# Altium schematic sheet DCDCreg.SchDoc: Regulated Buck-Boost I2C
size 292 x 193 mm; CheckedBy: Jakub Howors; Author: Łukasz Gójski; CompanyName: Politechnika Warszawska; Organization: EITI; Address1: Nowowiejska 15/19; Address2: 00-665 Warszawa; SheetNumber: 4; SheetTotal: 13; HTTPLink: www.pw.edu.pl
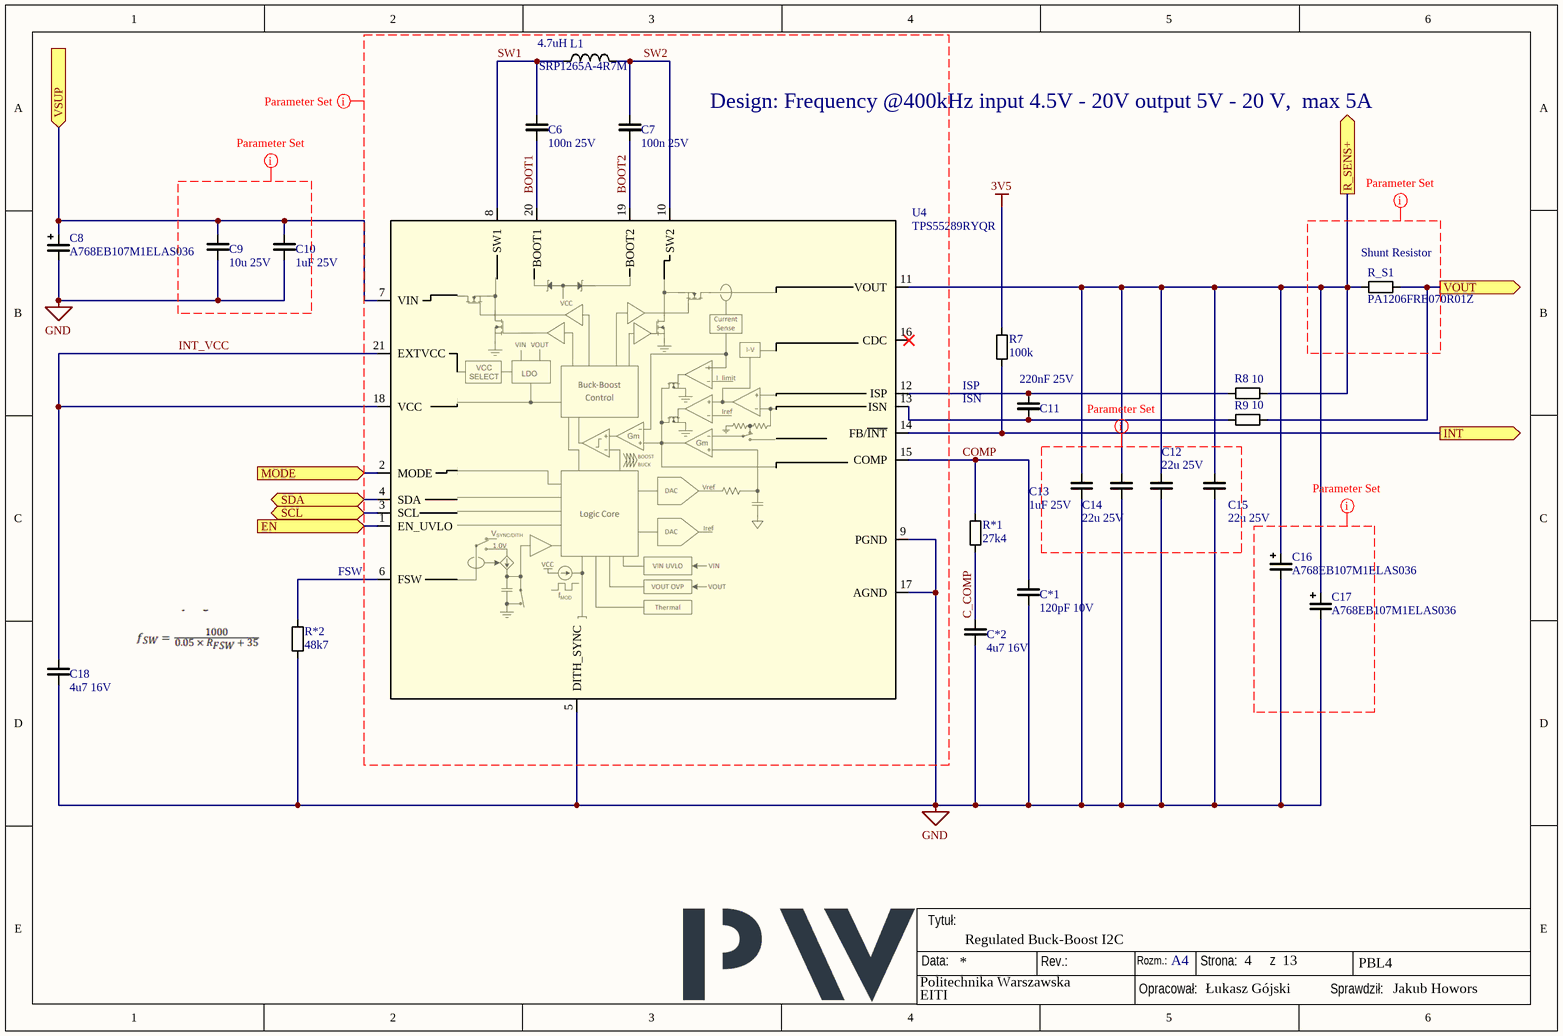
[diagram p0: DCDCreg.SchDoc]

## Parts
C6  100n 25V  [C_0603]
C7  100n 25V  [C_0603]
C8  A768EB107M1ELAS036  [CAP_A768EB_6.8x6.8_KEM]
C9  10u 25V  [C_0805]
C10  1uF 25V  [C_0603]
C11  220nF 25V  [C_0603]
C12  22u 25V  [C_1206]
C13  1uF 25V  [C_0603]
C14  22u 25V  [C_1206]
C15  22u 25V  [C_1206]
C16  A768EB107M1ELAS036  [CAP_A768EB_6.8x6.8_KEM]
C17  A768EB107M1ELAS036  [CAP_A768EB_6.8x6.8_KEM]
C18  4u7 16V  [C_0603]
C*1  120pF 10V  [C_0603]
C*2  4u7 16V  [C_0603]
L1  SRP1265A-4R7M  [SRP1265A-4R7M]
R7  100k  [R_0603]
R8  10  [R_0603]
R9  10  [R_0603]
R*1  27k4  [R_0603]
R*2  48k7  [R_0603]
R_S1  PA1206FRE070R01Z  [R_1206]
U4  TPS55289RYQR  [RYQ0021A-MFG]

## Ports
EN (in, see PowerAssembly[5B]), INT (out, see PowerAssembly[6B]), MODE (in, see PowerAssembly[5C]), R_SENS+ (out, see PowerAssembly[6B]), SCL (bidir, see PowerAssembly[5B], ADCHighVoltageInputsSchDoc[2A], DAC[3C], GPIOExpander[2B], PWMExpander[2B], USBPD[4C]), SDA (bidir, see PowerAssembly[5B], ADCHighVoltageInputsSchDoc[2A], DAC[3C], GPIOExpander[2B], PWMExpander[2A], USBPD[4C]), VOUT (out, see PowerAssembly[6B]), VSUP (in, see PowerAssembly[5B])

## Nets
3V5: R7.2
GND: C8.2 C9.1 C10.1 C12.1 C13.1 C14.1 C15.1 C16.2 C17.2 C18.1 C*1.1 C*2.1 R*2.1 U4.5(DITH_SYNC) U4.9(PGND) U4.17(AGND)
BOOT1: C6.1 U4.20(BOOT1)
BOOT2: C7.1 U4.19(BOOT2)
C_COMP: C*2.2 R*1.1
COMP: C*1.2 R*1.2 U4.15(COMP)
EN: U4.1(EN_UVLO) ; port EN
INT: R7.1 U4.14(FB/~{INT}) ; port INT
INT_VCC: C18.2 U4.18(VCC) U4.21(EXTVCC)
MODE: U4.2(MODE) ; port MODE
R_SENS+: C12.2 C13.2 C14.2 C15.2 C16.1 C17.1 R8.1 R_S1.1 U4.11(VOUT) ; port R_SENS+
SCL: U4.3(SCL) ; port SCL
SDA: U4.4(SDA) ; port SDA
SW1: C6.2 L1.1 U4.8(SW1)
SW2: C7.2 L1.2 U4.10(SW2)
VOUT: R9.1 R_S1.2 ; port VOUT
VSUP: C8.1 C9.2 C10.2 U4.7(VIN) ; port VSUP
NetC11_1: C11.1 R9.2 U4.13(ISN)
NetC11_2: C11.2 R8.2 U4.12(ISP)
NetR*2_2: R*2.2 U4.6(FSW)

Not connected (* = marked no-connect by the designer): U4 16(CDC)*

## Layout directives
CompClassName: NoRelief: (no net found under the mark), BOOT1, BOOT2, R_SENS+, SW1, SW2
CompClassName: ThickRelief: (no net found under the mark)

## Notes on the sheet
- (near L1) 4.7uH
- Design: Frequency @400kHz input 4.5V - 20V output 5V - 20 V,  max 5A
- (near R_S1) Shunt Resistor
- (near R7) ISP
- ISN
- (near U4) FSW
- Data:
- Tytuł:
- Rev.:
- Rozm.:
- A4
- Strona:
- z
- PBL4
- Opracował:
- Sprawdził:

## Library data of the parts
C6 C7 = C_100nF_25V: Ceramic capacitor; Casing: 0603; Dielectric: X7R; Tolerance: 10%; Value: 100n; Voltage: 25V; Technology: Ceramic
C8 C16 C17 = C_Pol_100uF_25V: Aluminum Organic Polymer Capacitors 25Vol 100uF SMD 2KHr ESR=36 mOhms AECQ200; Manufacturer: KEMET; Voltage: 25V; Tolerance: 20%; Value: 100uF; ComponentLink1Description: Datasheet; ComponentLink1URL: https://yageogroup.com/content/datasheet/asset/file/KEM_A4088_A768; ComponentLink2Description: Supplier; ComponentLink2URL: https://www.digikey.pl/pl/products/detail/kemet/A768EB107M1ELAS036/13420071
C9 = C_10uF_25V: Ceramic capacitor; Casing: 0805; Dielectric: X5R; Tolerance: 10%; Value: 10u; Voltage: 25V; Technology: Ceramic
C10 C13 = C_1uF_25V: Ceramic capacitor; Value: 1u; Casing: 0603; Dielectric: XR7; Tolerance: 10%; Voltage: 25V; Technology: Ceramic
C11 = C_220nF_25V: Ceramic capacitor; Value: 220n; Casing: 0603; Dielectric: XR7; Tolerance: 10%; Voltage: 25V; Technology: Ceramic
C12 C14 C15 = C_22uF_25V: Ceramic capacitor; Casing: 1206; Dielectric: X7R; Tolerance: 20%; Value: 22u; Voltage: 25V; Technology: Ceramic
C18 C*2 = C_4u7_16V: Ceramic capacitor; Casing: 0603; Dielectric: X5R; Tolerance: 10%; Value: 4u7; Voltage: 16V; Technology: Ceramic
C*1 = C_120pF_10V: Ceramic capacitor; Value: 120p; Casing: 0603; Dielectric: XR7; Tolerance: 10%; Voltage: 10V; Technology: Ceramic
L1 = L_4u7_10.5A: Inductor, 4.7 uF , 10A; Manufacturer: Bourns Inc.; Value: 4u7; Tolerance: 20%; IDC: 10A
R7 = R_100k: Resistor; Tolerance: 1%; Power: 100mW; Casing: 0603; Value: 100k
R8 R9 = R_10R: Tolerance: 1%; Power: 100mW; Casing: 0603; Value: 10
R*1 = R_27k4: Resistor; Tolerance: 1%; Power: 100mW; Casing: 0603; Value: 27k4
R*2 = R_48k7: Resistor; Tolerance: 1%; Power: 100mW; Casing: 0603; Value: 48k7
R_S1 = R_10mR: Shunt Resistor 10 mR, 1206, 250mW; Value: 10mR; Tolerance: 1%; Casing: 1206; Power: 250mW
U4 = TPS55289RYQR: 30-V, 8-A buck-boost converter with I2C interface; Manufacturer: Texas Instruments; Manufacturer_Part_Number: TPS55289RYQR; ComponentLink1Description: Datasheet; ComponentLink1URL: https://www.ti.com/lit/ds/symlink/tps55289.pdf; ComponentLink2Description: Supplier; ComponentLink2URL: https://www.digikey.pl/pl/products/detail/texas-instruments/TPS55289RYQR/16928303?s=N4IgTCBcDaIC4AcDOBWFYAcBOASgTwEcAnEAXQF8g; ComponentLink3Description: Supplier; ComponentLink3URL: https://www.mouser.pl/ProductDetail/Texas-Instruments/TPS55289RYQR?qs=T%252BzbugeAwjhgaIN94Lbpjg%3D%3D&utm_id=20109199562&utm_source=google&utm_medium=cpc&utm_marketing_tactic=emeacorp